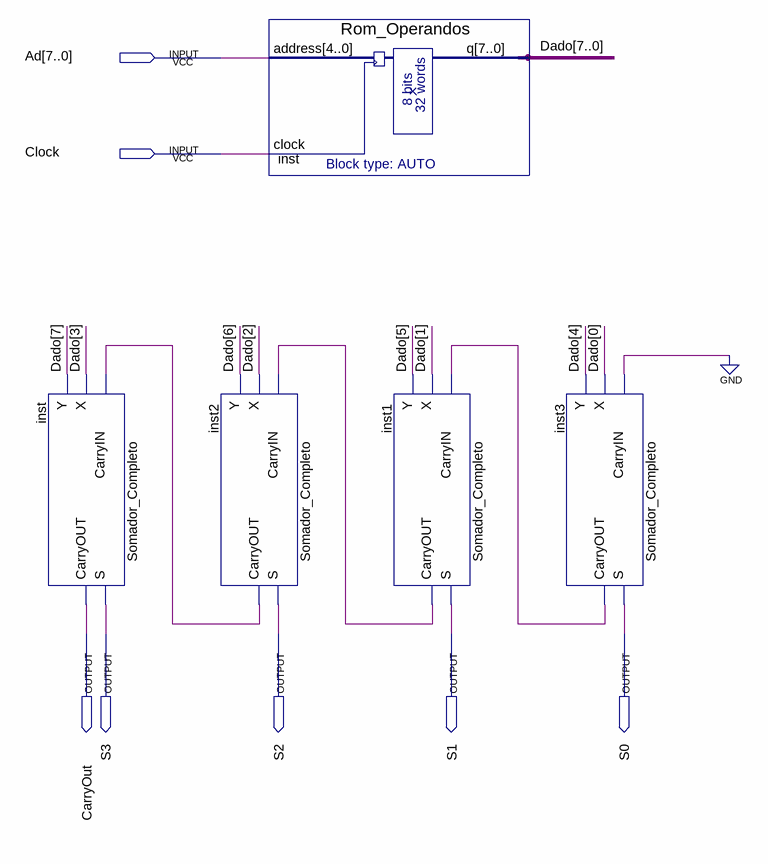
[diagram p0: schematic sheet]
// Quartus schematic Somador_4_Bits.bdf as structural Verilog: 5 symbols, 7 pins
module Somador_4_Bits (
  input  [7:0] Ad,
  input  Clock,
  output CarryOut,
  output S3,
  output S2,
  output S1,
  output S0
);

  wire inst1_carryout, inst2_carryout, inst3_carryout, undriven;
  wire [7:0] Dado;

  Somador_Completo inst (.CarryIN(inst2_carryout), .X(Dado[3]), .Y(Dado[7]), .S(S3), .CarryOUT(CarryOut));
  Somador_Completo inst2 (.CarryIN(inst1_carryout), .X(Dado[2]), .Y(Dado[6]), .S(S2), .CarryOUT(inst2_carryout));
  Rom_Operandos inst_dup2 (.address({5{undriven}}), .clock(Clock), .q(Dado));
  Somador_Completo inst1 (.CarryIN(inst3_carryout), .X(Dado[1]), .Y(Dado[5]), .S(S1), .CarryOUT(inst1_carryout));
  Somador_Completo inst3 (.CarryIN(1'b0), .X(Dado[0]), .Y(Dado[4]), .S(S0), .CarryOUT(inst3_carryout));
endmodule
